# EasyEDA Pro project ProPrj_ESP32-S3-DEVKIT_Sensor_Project_2026-01-14.epro

# Schematic Schematic1
Board Name: Board1; Create Date: 2026-01-12; Page Name: P1; Project Name: ESP32-S3-DEVKIT_Sensor_Project; Schematic Name: Schematic1; Update Date: 2026-01-13; Company: EasyEDA.com; Page Size: A4; Version: V1.0
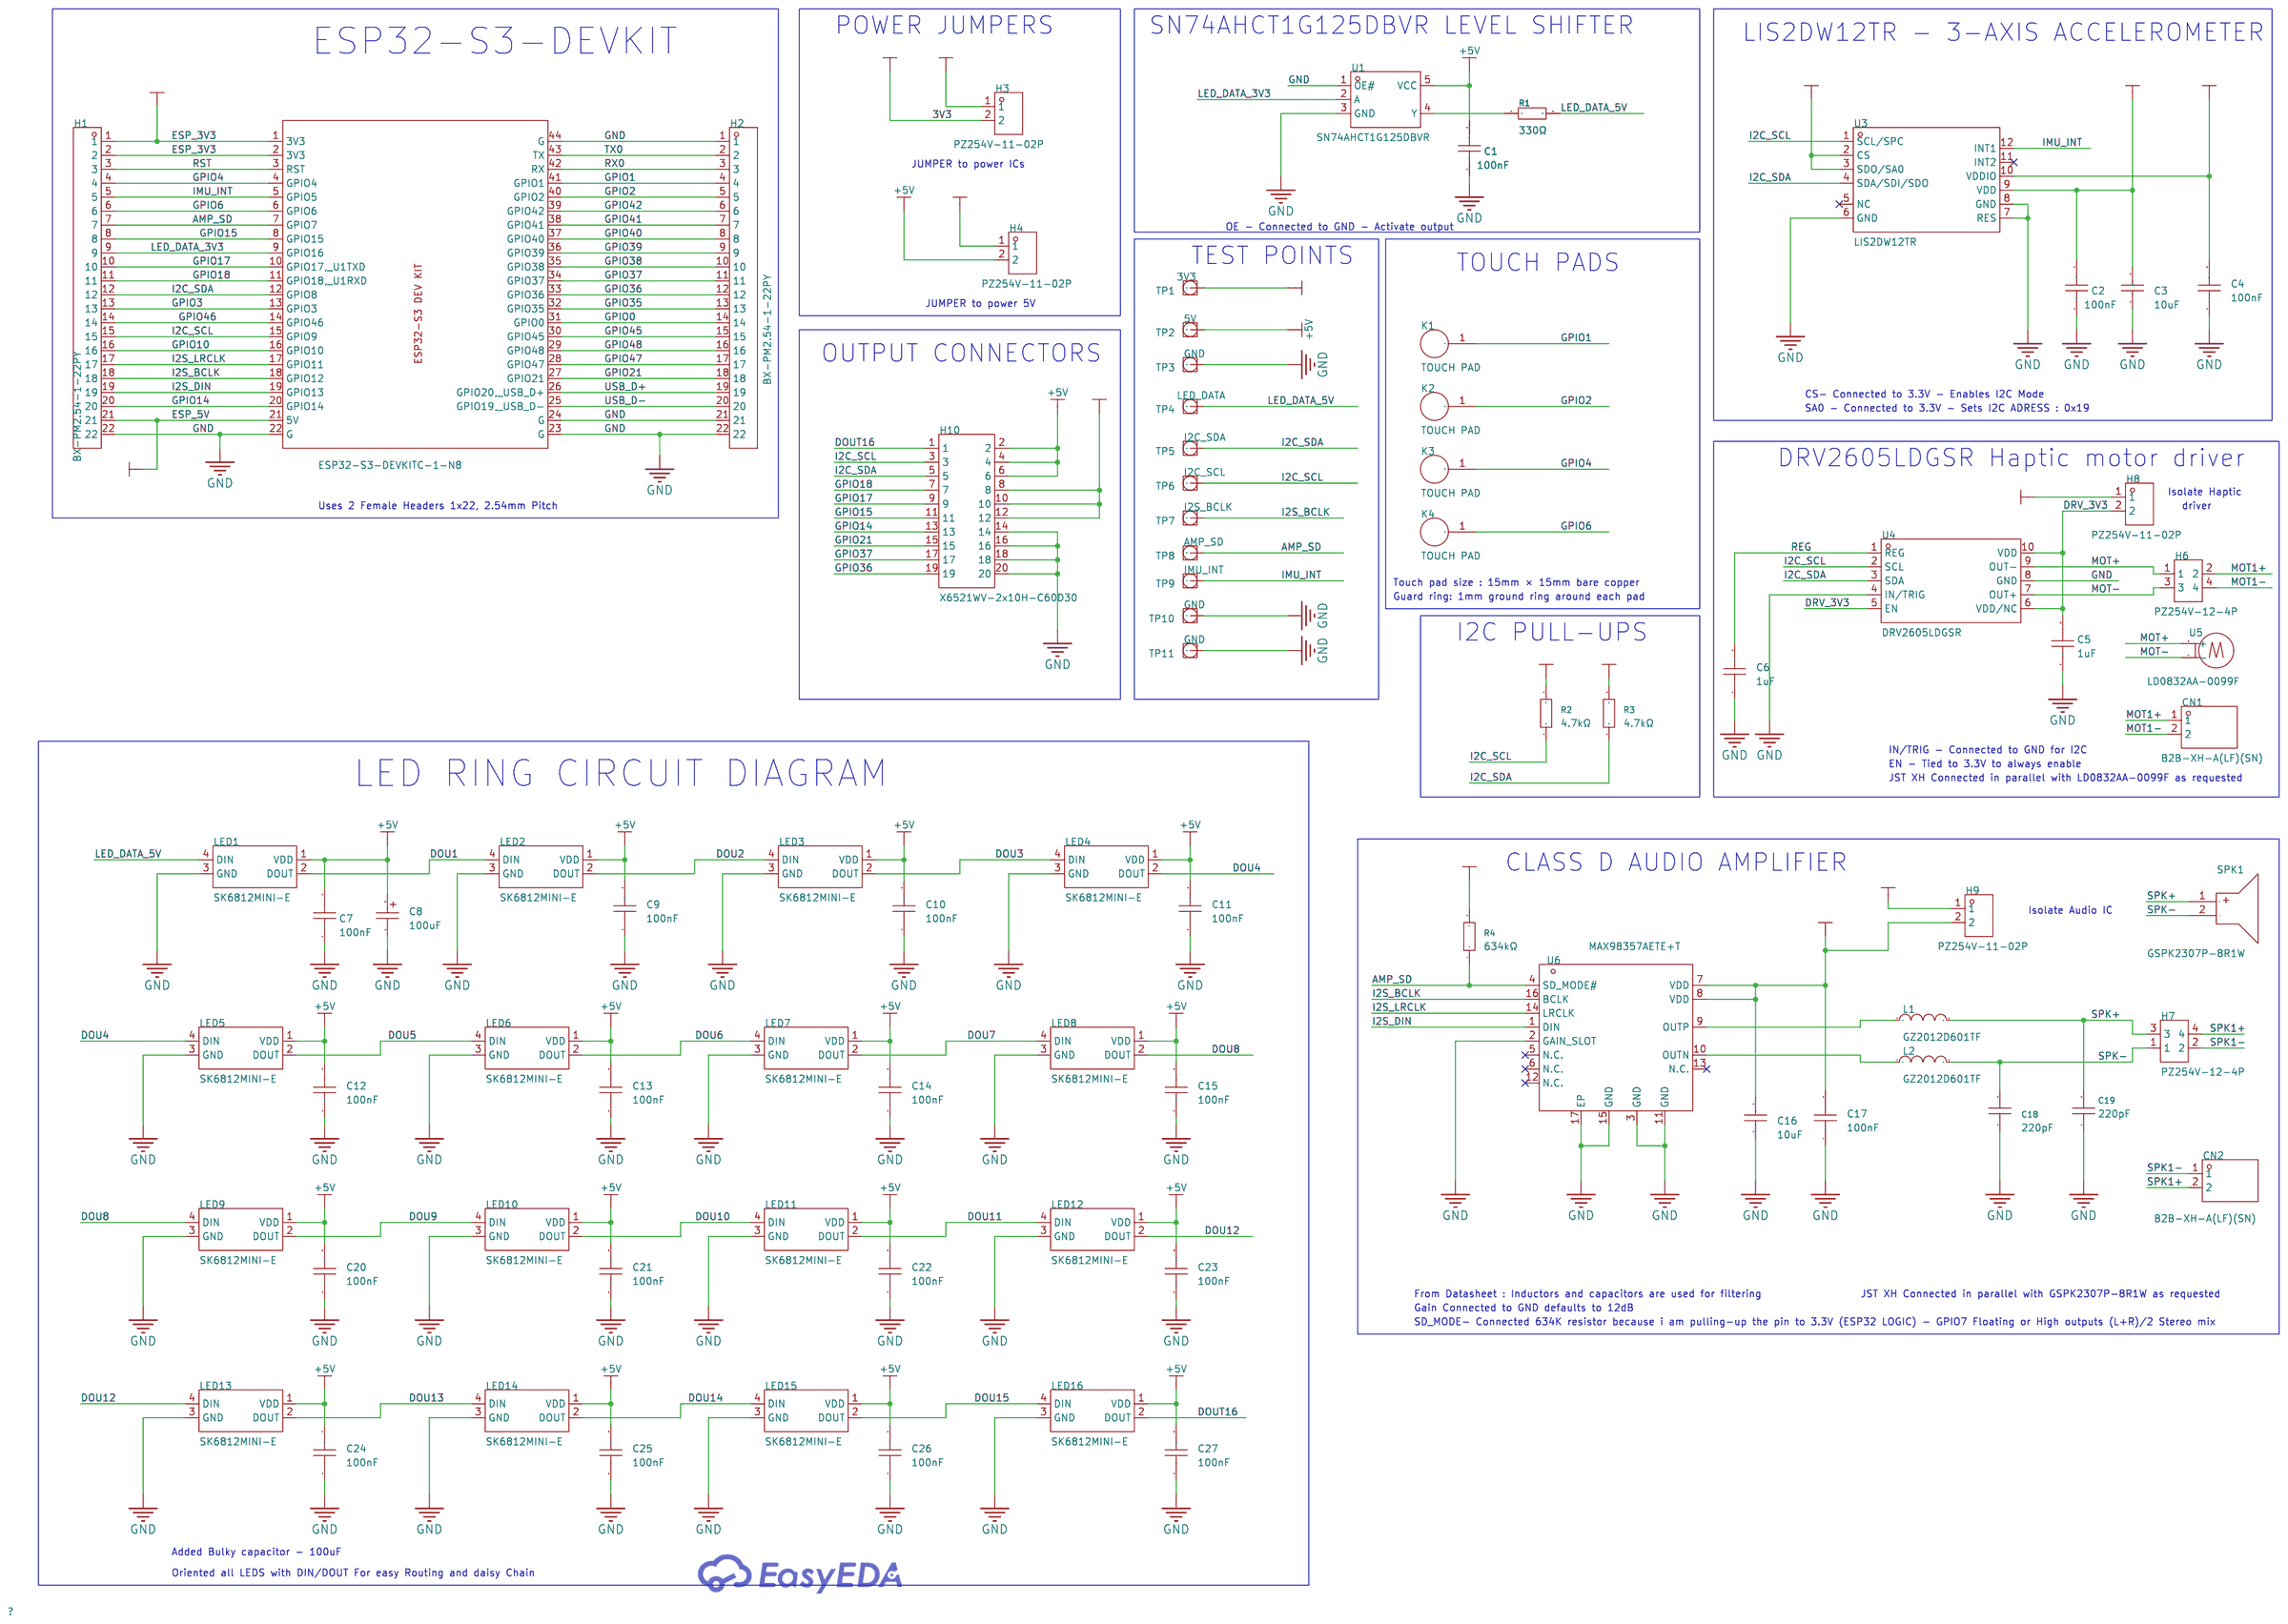
[diagram p0: schematic sheet]

## Parts
C1  100nF  [C0402]
C2  100nF  [C0402]
C3  10uF  [C0402]
C4  100nF  [C0402]
C5  1uF  [C0402]
C6  1uF  [C0402]
C7  100nF  [C0402]
C8  100uF  [CASE-B_3528]
C9  100nF  [C0402]
C10  100nF  [C0402]
C11  100nF  [C0402]
C12  100nF  [C0402]
C13  100nF  [C0402]
C14  100nF  [C0402]
C15  100nF  [C0402]
C16  10uF  [C0402]
C17  100nF  [C0402]
C18  220pF  [C0603]
C19  220pF  [C0603]
C20  100nF  [C0402]
C21  100nF  [C0402]
C22  100nF  [C0402]
C23  100nF  [C0402]
C24  100nF  [C0402]
C25  100nF  [C0402]
C26  100nF  [C0402]
C27  100nF  [C0402]
CN1  B2B-XH-A(LF)(SN)  [CONN-TH_B2B-XH-A-LF-SN]
CN2  B2B-XH-A(LF)(SN)  [CONN-TH_B2B-XH-A-LF-SN]
H1  BX-PM2.54-1-22PY  [HDR-TH_22P-P2.54-V-F]
H2  BX-PM2.54-1-22PY  [HDR-TH_22P-P2.54-V-F]
H3  PZ254V-11-02P  [HDR-TH_2P-P2.54-V-M]
H4  PZ254V-11-02P  [HDR-TH_2P-P2.54-V-M]
H6  PZ254V-12-4P  [HDR-TH_4P-P2.54-V-M-R2-C2-S2.54]
H7  PZ254V-12-4P  [HDR-TH_4P-P2.54-V-M-R2-C2-S2.54]
H8  PZ254V-11-02P  [HDR-TH_2P-P2.54-V-M]
H9  PZ254V-11-02P  [HDR-TH_2P-P2.54-V-M]
H10  X6521WV-2x10H-C60D30  [HDR-TH_20P-P2.54-V-M-R2-C10-S2.54]
K1  TOUCH PAD  [TOUCH_PAD]
K2  TOUCH PAD  [TOUCH_PAD]
K3  TOUCH PAD  [TOUCH_PAD]
K4  TOUCH PAD  [TOUCH_PAD]
L1  GZ2012D601TF  [L0805]
L2  GZ2012D601TF  [L0805]
LED1  SK6812MINI-E  [LED-SMD_L3.2-W2.8-LS5.9_SK6812MINI-E]
LED2  SK6812MINI-E  [LED-SMD_L3.2-W2.8-LS5.9_SK6812MINI-E]
LED3  SK6812MINI-E  [LED-SMD_L3.2-W2.8-LS5.9_SK6812MINI-E]
LED4  SK6812MINI-E  [LED-SMD_L3.2-W2.8-LS5.9_SK6812MINI-E]
LED5  SK6812MINI-E  [LED-SMD_L3.2-W2.8-LS5.9_SK6812MINI-E]
LED6  SK6812MINI-E  [LED-SMD_L3.2-W2.8-LS5.9_SK6812MINI-E]
LED7  SK6812MINI-E  [LED-SMD_L3.2-W2.8-LS5.9_SK6812MINI-E]
LED8  SK6812MINI-E  [LED-SMD_L3.2-W2.8-LS5.9_SK6812MINI-E]
LED9  SK6812MINI-E  [LED-SMD_L3.2-W2.8-LS5.9_SK6812MINI-E]
LED10  SK6812MINI-E  [LED-SMD_L3.2-W2.8-LS5.9_SK6812MINI-E]
LED11  SK6812MINI-E  [LED-SMD_L3.2-W2.8-LS5.9_SK6812MINI-E]
LED12  SK6812MINI-E  [LED-SMD_L3.2-W2.8-LS5.9_SK6812MINI-E]
LED13  SK6812MINI-E  [LED-SMD_L3.2-W2.8-LS5.9_SK6812MINI-E]
LED14  SK6812MINI-E  [LED-SMD_L3.2-W2.8-LS5.9_SK6812MINI-E]
LED15  SK6812MINI-E  [LED-SMD_L3.2-W2.8-LS5.9_SK6812MINI-E]
LED16  SK6812MINI-E  [LED-SMD_L3.2-W2.8-LS5.9_SK6812MINI-E]
R1  330Ω  [R0402]
R2  4.7kΩ  [R0402]
R3  4.7kΩ  [R0402]
R4  634kΩ  [R0402]
SPK1  GSPK2307P-8R1W  [SPK-TH_BD23.0-P10.00-D0.8-L-RD]
TP1  3V3  [TESTPOINT-TH_BD3.2_1]
TP2  5V  [TESTPOINT-TH_BD3.2_1]
TP3  GND  [TESTPOINT-TH_BD3.2_1]
TP4  LED_DATA  [TESTPOINT-TH_BD3.2_1]
TP5  I2C_SDA  [TESTPOINT-TH_BD3.2_1]
TP6  I2C_SCL  [TESTPOINT-TH_BD3.2_1]
TP7  I2S_BCLK  [TESTPOINT-TH_BD3.2_1]
TP8  AMP_SD  [TESTPOINT-TH_BD3.2_1]
TP9  IMU_INT  [TESTPOINT-TH_BD3.2_1]
TP10  GND  [TESTPOINT-TH_BD3.2_1]
TP11  GND  [TESTPOINT-TH_BD3.2_1]
U1  SN74AHCT1G125DBVR  [SOT-23-5_L3.0-W1.7-P0.95-LS2.8-BR]
U2  ESP32-S3-DEVKITC-1-N8  [CONN-TH_ESP32-S3-DEVKITC-1U-N8]
U3  LIS2DW12TR  [LGA-12_L2.0-W2.0-P0.50-BL]
U4  DRV2605LDGSR  [VSSOP-10_L3.0-W3.0-P0.50-LS4.9-BL]
U5  LD0832AA-0099F  [FL_002]
U6  MAX98357AETE+T  [TQFN-16_L3.0-W3.0-P0.50-BL-EP1.5]

## Library data of the parts
C1 C2 C4 C7 C9-C15 C17 C20-C27 = CL05B104KO5NNNC: Capacitance:100nF Tolerance:±10% Tolerance:±10% Voltage Rating:16V Temperature Coefficient:X7R; LCSC Part Name: 100nF ±10% 16V; Supplier Part: C1525; Manufacturer: SAMSUNG(三星); Supplier Footprint: 0402; Datasheet: https://item.szlcsc.com/datasheet/CL05B104KO5NNNC/1877.html; Supplier: LCSC; Tolerance: ±10%; Voltage Rating: 16V; Temperature Coefficient: X7R
C3 C16 = CL05A106MQ5NUNC: Capacitance:10uF Tolerance:±20% Tolerance:±20% Voltage Rating:6.3V Temperature Coefficient:X5R; LCSC Part Name: 10uF ±20% 6.3V; Supplier Part: C15525; Manufacturer: SAMSUNG(三星); Supplier Footprint: 0402; Datasheet: https://item.szlcsc.com/datasheet/CL05A106MQ5NUNC/16204.html; Supplier: LCSC; Tolerance: ±20%; Voltage Rating: 6.3V; Temperature Coefficient: X5R
C5 C6 = CL05A105KA5NQNC: Capacitance:1uF Tolerance:±10% Tolerance:±10% Voltage Rating:25V Temperature Coefficient:X5R; LCSC Part Name: 1uF ±10% 25V; Supplier Part: C52923; Manufacturer: SAMSUNG(三星); Supplier Footprint: 0402; Datasheet: https://item.szlcsc.com/datasheet/CL05A105KA5NQNC/53938.html; Supplier: LCSC; Tolerance: ±10%; Voltage Rating: 25V; Temperature Coefficient: X5R
C8 = TAJB107M010RNJ: Capacitance: Tolerance:±20% Tolerance:±20% Rated Voltage: Equivalent Series Resistance(ESR):1.4Ω@100kHz Operating Temperature:-55℃~+125℃ Operating Temperature:-55℃~+125℃; LCSC Part Name: 100uF ±20% 10V; Supplier Part: C7196; Manufacturer: Kyocera AVX; Supplier Footprint: CASE-B-3528; Datasheet: https://atta.szlcsc.com/upload/public/pdf/source/20160107/1457707750344.pdf; Supplier: LCSC; Tolerance: ±20%; Equivalent Series Resistance(ESR): 1.4Ω@100kHz; Operating Temperature: -55℃~+125℃
C18 C19 = CL10B221KB8NNNC: Capacitance:220pF Tolerance:±10% Tolerance:±10% Voltage Rating:50V Temperature Coefficient:X7R; LCSC Part Name: 220pF ±10% 50V; Supplier Part: C1603; Manufacturer: SAMSUNG(三星); Supplier Footprint: 0603; JLCPCB Part Class: Basic Part; Datasheet: https://item.szlcsc.com/datasheet/CL10B221KB8NNNC/1955.html; Supplier: LCSC; Tolerance: ±10%; Voltage Rating: 50V; Temperature Coefficient: X7R
CN1 CN2 = B2B-XH-A(LF)(SN): Pins Structure:1x2P Pitch:2.5mm Mounting Type:Through Hole Reference Series:XH Number of Pins:2P Number of Rows:1 Number of PINs Per Row:2 Row Spacing:- Current Rating:3A Contact Material:Brass Contact Plating:Tin Operating Temperature:-25℃~+85℃ Operating; LCSC Part Name: 1x2P 间距:2.5mm 直插 系列:XH; Supplier Part: C158012; Manufacturer: JST; Supplier Footprint: 插件,P=2.5mm; Datasheet: https://item.szlcsc.com/datasheet/B2B-XH-A(LF)(SN)/169360.html; Supplier: LCSC; Pins Structure: 1x2P; Pitch: 2.5mm; Mounting Type: Through Hole; Reference Series: XH; Number of Pins: 2P; Number of Rows: 1; Number of PINs Per Row: 2; Current Rating: 3A; Contact Material: Brass; Contact Plating: Tin; Operating Temperature: -25℃~+85℃; Voltage Rating: 250V; Plastic Material: PA66; Flame Retardant Rating: UL94V-0; Supplementary Features: K Pin; Color: White; Z-Height of the Board: 7mm; X-Length of Bottom Edge on Board (Spacing Line): 7.4mm; Y-Width of Bottom Edge on Board: 5.75mm
H1 H2 = BX-PM2.54-1-22PY: Holes Structure:1x22P Pitch:2.54mm Row Spacing:- Circular Hole / Square Hole:Square Hole Mounting Type:Through Hole Number of Rows:1 Number of Positions:22P Current Rating:3A Voltage Rating (Max):- Holes Direction:Top Insulation Height:8.5mm Contact Mater; LCSC Part Name: 1x22P 间距:2.54mm 直插; Supplier Part: C18078140; Manufacturer: Bossie(博锡); Supplier Footprint: 插件,P=2.54mm; Datasheet: https://item.szlcsc.com/datasheet/BX-PM2.54-1-22PY/19218541.html; Supplier: LCSC; Holes Structure: 1x22P; Pitch: 2.54mm; Circular Hole / Square Hole: Square Hole; Mounting Type: Through Hole; Number of Rows: 1; Number of Positions: 22P; Current Rating: 3A; Holes Direction: Top; Insulation Height: 8.5mm; Contact Material: Brass; Contact Plating: Gold; Operating Temperature: -40℃~+105℃; PIN Length: 3.2mm
H3 H4 H8 H9 = PZ254V-11-02P: Supplier: LCSC; Supplier Part: C492401; Manufacturer: XFCN; JLCPCB Part Class: Extended Part
H6 H7 = PZ254V-12-4P: Pin Structure:2x2P Pitch:2.54mm Row Spacing:2.54mm Circluar Pins/Square Pins:Pin Header Mounting Type:Through Hole Number of Rows:2 Number of Pins:4P Current Rating:- Voltage Rating (Max):- Length of Mating Pin:6mm Insulation Height:2.5mm Length of End Co; LCSC Part Name: 2x2P 间距:2.54mm 方针 直插; Supplier Part: C492419; Manufacturer: XFCN(兴飞); Supplier Footprint: 插件,P=2.54mm; JLCPCB Part Class: Extended Part; Datasheet: https://item.szlcsc.com/datasheet/PZ254V-12-4P/502975.html; Supplier: LCSC; Pin Structure: 2x2P; Pitch: 2.54mm; Row Spacing: 2.54mm; Circluar Pins/Square Pins: Pin Header; Mounting Type: Through Hole; Number of Rows: 2; Number of Pins: 4P; Length of Mating Pin: 6mm; Insulation Height: 2.5mm; Length of End Connection Pin: 3mm; Contact Material: Brass; Operating Temperature: -40℃~+105℃; Color: Black
H10 = X6521WV-2x10H-C60D30: Pin Structure:2x10P Pitch:2.54mm Row Spacing:2.54mm Circluar Pins/Square Pins:Policy Number of Rows:Double Row Number of Pins:20P Current Rating:3A Voltage Rating (Max):250V Length of Mating Pin:- Insulation Height:2.5mm Length of End Connection Pin:- Con; LCSC Part Name: 2x10P 间距:2.54mm 方针; Supplier Part: C706900; Manufacturer: XKB Connection(中国星坤); Supplier Footprint: 插件,P=2.54mm; Datasheet: https://item.szlcsc.com/datasheet/X6521WV-2x10H-C60D30/744022.html; Supplier: LCSC; Pin Structure: 2x10P; Pitch: 2.54mm; Row Spacing: 2.54mm; Circluar Pins/Square Pins: Policy; Number of Rows: Double Row; Number of Pins: 20P; Current Rating: 3A; Voltage Rating (Max): 250V; Insulation Height: 2.5mm; Contact Material: Brass; Contact Plating: Gold; Operating Temperature: -40℃~+105℃; Color: Black
K1-K4 = TOUCH PAD: Manufacturer Part: Touch
L1 L2 = GZ2012D601TF: Impedance @ Frequency:600Ω@100MHz Tolerance:±25% Tolerance:±25% DC Resistance(DCR):300mΩ Current Rating:500mA Number of Circuits:1; LCSC Part Name: 单路 0805磁珠 阻抗600Ω@100MHz; Supplier Part: C1017; Manufacturer: Sunlord(顺络); Supplier Footprint: 0805; JLCPCB Part Class: Basic Part; Datasheet: https://atta.szlcsc.com/upload/public/pdf/source/20241120/893429B990C3BA07384E734821D2F218.pdf; Supplier: LCSC; Impedance @ Frequency: 600Ω@100MHz; Tolerance: ±25%; DC Resistance(DCR): 300mΩ; Current Rating: 500mA; Number of Circuits: 1
LED1-LED16 = SK6812MINI-E_C5149201: Supplier Part: C5149201; Manufacturer: 欧思科光电; Supplier Footprint: SMD; Datasheet: https://item.szlcsc.com/datasheet/SK6812MINI-E/5773397.html; Supplier: LCSC
R1 = 0402WGF3300TCE: Type:Thick Film Resistors Resistance:330Ω Tolerance:±1% Tolerance:±1% Power(Watts):1/16W Voltage-Supply(Max):50V Temperature Coefficient:±100ppm/℃ Temperature Coefficient:±100ppm/℃ Operating Temperature:-55℃~+155℃ Operating Temperature:-55℃~+155℃; LCSC Part Name: 330Ω ±1% 62.5mW 厚膜电阻; Supplier Part: C25104; Manufacturer: UNI-ROYAL(厚声); Supplier Footprint: 0402; Datasheet: https://item.szlcsc.com/datasheet/0402WGF3300TCE/25847.html; Supplier: LCSC; Type: Thick Film Resistors; Tolerance: ±1%; Power(Watts): 1/16W; Voltage-Supply(Max): 50V; Temperature Coefficient: ±100ppm/℃; Operating Temperature: -55℃~+155℃
R2 R3 = 0402WGF4701TCE: Type:Thick Film Resistor Resistance:4.7kΩ Tolerance:±1% Tolerance:±1% Power(Watts):62.5mW Voltage-Supply(Max):50V Temperature Coefficient:±100ppm/℃ Temperature Coefficient:±100ppm/℃ Operating Temperature:-55℃~+155℃ Operating Temperature:-55℃~+155℃; LCSC Part Name: 4.7kΩ ±1% 62.5mW 厚膜电阻; Supplier Part: C25900; Manufacturer: UNI-ROYAL(厚声); Supplier Footprint: 0402; Datasheet: https://item.szlcsc.com/datasheet/0402WGF4701TCE/26643.html; Supplier: LCSC; Type: Thick Film Resistor; Tolerance: ±1%; Power(Watts): 62.5mW; Voltage-Supply(Max): 50V; Temperature Coefficient: ±100ppm/℃; Operating Temperature: -55℃~+155℃
R4 = 0402WGF6343TCE: Type:Thick Film Resistor Resistance:634kΩ Tolerance:±1% Tolerance:±1% Power(Watts):62.5mW Voltage-Supply(Max):50V Temperature Coefficient:±100ppm/℃ Temperature Coefficient:±100ppm/℃ Operating Temperature:-55℃~+155℃ Operating Temperature:-55℃~+155℃; LCSC Part Name: 634kΩ ±1% 62.5mW 厚膜电阻; Supplier Part: C270588; Manufacturer: UNI-ROYAL(厚声); Supplier Footprint: 0402; Datasheet: https://item.szlcsc.com/datasheet/0402WGF6343TCE/259968.html; Supplier: LCSC; Type: Thick Film Resistor; Tolerance: ±1%; Power(Watts): 62.5mW; Voltage-Supply(Max): 50V; Temperature Coefficient: ±100ppm/℃; Operating Temperature: -55℃~+155℃
SPK1 = GSPK2307P-8R1W: Technology:Electromagnetic Impedance:8Ω Resonant Frequency:1.7kHz Total Harmonic Distortion(THD):5% Total Harmonic Distortion(THD):5% Rated Power:500mW Sound Pressure Level(SPL):88dB Diameter(φD):23mm Height:6.8mm Operating Temperature:-40℃~+85℃ Operating; LCSC Part Name: 23mm 8Ω; Supplier Part: C530531; Manufacturer: INGHAi(赢海); JLCPCB Part Class: Extended Part; Datasheet: https://item.szlcsc.com/datasheet/GSPK2307P-8R1W/550865.html; Supplier: LCSC; Technology: Electromagnetic; Impedance: 8Ω; Resonant Frequency: 1.7kHz; Total Harmonic Distortion(THD): 5%; Rated Power: 500mW; Sound Pressure Level(SPL): 88dB; Diameter(φD): 23mm; Height: 6.8mm; Operating Temperature: -40℃~+85℃
TP1-TP11 = TPoint2: Test Point; Supplier Part: C9900007422; Supplier Footprint: TESTPOINT-TH_BD-2P-P2.00; Supplier: LCSC
U1 = SN74AHCT1G125DBVR: output type:Tri-State Voltage - Supply:4.5V~5.5V Voltage - Supply:4.5V~5.5V Number of Elements:1 Number of Bits per Element:1 Channel Type:Unidirectional Current - Output Low(IOL):8mA Current - Output High(IOH):8mA Logic Family:74AHCT Operating Temperatur; LCSC Part Name: 三态输出，单路总线缓冲门; Supplier Part: C7484; Manufacturer: TI(德州仪器); Supplier Footprint: SOT-23-5; JLCPCB Part Class: Extended Part; Datasheet: https://www.ti.com/cn/lit/gpn/sn74ahct1g125; Supplier: LCSC; output type: Tri-State; Voltage - Supply: 4.5V~5.5V; Number of Elements: 1; Number of Bits per Element: 1; Channel Type: Unidirectional; Current - Output Low(IOL): 8mA; Current - Output High(IOH): 8mA; Logic Family: 74AHCT; Operating Temperature: -40℃~+125℃; Quiescent Current: 10uA; Propagation Delay: 6.5ns@5V,15pF
U2 = ESP32-S3-DEVKITC-1-N8: Supplier Part: C20438410; Manufacturer: ESPRESSIF(乐鑫); JLCPCB Part Class: Extended Part; Supplier: LCSC
U3 = LIS2DW12TR: Axial Direction:X,Y,Z Supply Voltage:1.62V~3.6V Supply Voltage:1.62V~3.6V Operating Temperature:-40℃~+85℃ Operating Temperature:-40℃~+85℃; Supplier Part: C189624; Manufacturer: ST(意法半导体); Supplier Footprint: LGA-12(2x2); Datasheet: https://atta.szlcsc.com/upload/public/pdf/source/20180403/C189624_150963097ED842400E055DE40577DCB1.pdf; Supplier: LCSC; Axial Direction: X,Y,Z; Supply Voltage: 1.62V~3.6V; Operating Temperature: -40℃~+85℃
U4 = DRV2605LDGSR: Voltage - Supply:- Voltage - Supply:- Output Current:- Output Current:- Interface:I2C Operating Temperature:-40℃~+85℃ Operating Temperature:-40℃~+85℃; LCSC Part Name: 5.5V电机驱动芯片; Supplier Part: C527464; Manufacturer: TI(德州仪器); Supplier Footprint: VSSOP-10-0.5mm; Datasheet: https://www.ti.com/cn/lit/gpn/drv2605l; Supplier: LCSC; Interface: I2C; Operating Temperature: -40℃~+85℃
U5 = LD0832AA-0099F: Type:Linear Motor Voltage Rating:1.8V Voltage Rating:1.8V Current Rating:80mA Operating Temperature:-30℃~+70℃ Operating Temperature:-30℃~+70℃ Sense Of Rotation:-; LCSC Part Name: 线性0832 振动马达; Supplier Part: C2682305; Manufacturer: LEADER(立得); JLCPCB Part Class: Extended Part; Datasheet: https://item.szlcsc.com/datasheet/LD0832AA-0099F/2776655.html; Supplier: LCSC; Type: Linear Motor; Voltage Rating: 1.8V; Current Rating: 80mA; Operating Temperature: -30℃~+70℃
U6 = MAX98357AETE+T: Class:Class D Speaker Channels:- Output Power:3.2W×1@4Ω Voltage - Supply:2.5V~5.5V Voltage - Supply:2.5V~5.5V Total Harmonic Distortion + Noise (THD+N):- Quiescent Current:2.4mA Operating Temperature:-40℃~+85℃ Operating Temperature:-40℃~+85℃ Power Supply; LCSC Part Name: 微型、低成本、PCM 类 D 级放大器具有 AB 级性能; Supplier Part: C910544; Manufacturer: ADI(亚德诺)/MAXIM(美信); Supplier Footprint: TQFN-16-EP(3x3); JLCPCB Part Class: Extended Part; Datasheet: https://item.szlcsc.com/datasheet/MAX98357AETE%252BT/978950.html; Supplier: LCSC; Class: Class D; Output Power: 3.2W×1@4Ω; Voltage - Supply: 2.5V~5.5V; Quiescent Current: 2.4mA; Operating Temperature: -40℃~+85℃; Power Supply Rejection Ratio (PSRR): 77dB; Efficiency: 92%

## Nets
3V3: C2.2 C3.2 C4.2 H3.2 H8.1 H10.8 H10.10 H10.12 R2.2 R3.2 R4.2 TP1.1 U3.2(CS) U3.3(SDO/SA0) U3.9(VDD) U3.10(VDDIO)
+5V: C1.2 C7.2 C8.1 C9.2 C10.2 C11.2 C12.2 C13.2 C14.2 C15.2 C20.2 C21.2 C22.2 C23.2 C24.2 C25.2 C26.2 C27.2 H4.2 H10.2 H10.4 H10.6 LED1.1(VDD) LED2.1(VDD) LED3.1(VDD) LED4.1(VDD) LED5.1(VDD) LED6.1(VDD) LED7.1(VDD) LED8.1(VDD) LED9.1(VDD) LED10.1(VDD) LED11.1(VDD) LED12.1(VDD) LED13.1(VDD) LED14.1(VDD) LED15.1(VDD) LED16.1(VDD) TP2.1 U1.5(VCC)
GND: C1.1 C2.1 C3.1 C4.1 C5.1 C6.1 C7.1 C8.2 C9.1 C10.1 C11.1 C12.1 C13.1 C14.1 C15.1 C16.1 C17.1 C18.1 C19.1 C20.1 C21.1 C22.1 C23.1 C24.1 C25.1 C26.1 C27.1 H1.22 H2.1 H2.21 H2.22 H10.14 H10.16 H10.18 H10.20 LED1.3(GND) LED2.3(GND) LED3.3(GND) LED4.3(GND) LED5.3(GND) LED6.3(GND) LED7.3(GND) LED8.3(GND) LED9.3(GND) LED10.3(GND) LED11.3(GND) LED12.3(GND) LED13.3(GND) LED14.3(GND) LED15.3(GND) LED16.3(GND) TP3.1 TP10.1 TP11.1 U1.1(OE#) U1.3(GND) U2.22(G) U2.23(G) U2.24(G) U2.44(G) U3.6(GND) U3.7(RES) U3.8(GND) U4.4(IN/TRIG) U4.8(GND) U6.2(GAIN_SLOT) U6.3(GND) U6.11(GND) U6.15(GND) U6.17(EP)
VCC_5V: C16.2 C17.2 H9.2 U6.7(VDD) U6.8(VDD)
AMP_SD: H1.7 R4.1 TP8.1 U2.7(GPIO7) U6.4(SD_MODE#)
DOU1: LED1.2(DOUT) LED2.4(DIN)
DOU2: LED2.2(DOUT) LED3.4(DIN)
DOU3: LED3.2(DOUT) LED4.4(DIN)
DOU4: LED4.2(DOUT) LED5.4(DIN)
DOU5: LED5.2(DOUT) LED6.4(DIN)
DOU6: LED6.2(DOUT) LED7.4(DIN)
DOU7: LED7.2(DOUT) LED8.4(DIN)
DOU8: LED8.2(DOUT) LED9.4(DIN)
DOU9: LED9.2(DOUT) LED10.4(DIN)
DOU10: LED10.2(DOUT) LED11.4(DIN)
DOU11: LED11.2(DOUT) LED12.4(DIN)
DOU12: LED12.2(DOUT) LED13.4(DIN)
DOU13: LED13.2(DOUT) LED14.4(DIN)
DOU14: LED14.2(DOUT) LED15.4(DIN)
DOU15: LED15.2(DOUT) LED16.4(DIN)
DOUT16: H10.1 LED16.2(DOUT)
DRV_3V3: C5.2 H8.2 U4.5(EN) U4.6(VDD/NC) U4.10(VDD)
ESP_3V3: H1.1 H1.2 H3.1 U2.1(3V3) U2.2(3V3)
ESP_5V: H1.21 H4.1 H9.1 U2.21(5V)
GPIO0: H2.14 U2.31(GPIO0)
GPIO1: H2.4 K1.1 U2.41(GPIO1)
GPIO2: H2.5 K2.1 U2.40(GPIO2)
GPIO3: H1.13 U2.13(GPIO3)
GPIO4: H1.4 K3.1 U2.4(GPIO4)
GPIO6: H1.6 K4.1 U2.6(GPIO6)
GPIO10: H1.16 U2.16(GPIO10)
GPIO14: H1.20 H10.13 U2.20(GPIO14)
GPIO15: H1.8 H10.11 U2.8(GPIO15)
GPIO17: H1.10 H10.9 U2.10(GPIO17, U1TXD)
GPIO18: H1.11 H10.7 U2.11(GPIO18, U1RXD)
GPIO21: H2.18 H10.15 U2.27(GPIO21)
GPIO35: H2.13 U2.32(GPIO35)
GPIO36: H2.12 H10.19 U2.33(GPIO36)
GPIO37: H2.11 H10.17 U2.34(GPIO37)
GPIO38: H2.10 U2.35(GPIO38)
GPIO39: H2.9 U2.36(GPIO39)
GPIO40: H2.8 U2.37(GPIO40)
GPIO41: H2.7 U2.38(GPIO41)
GPIO42: H2.6 U2.39(GPIO42)
GPIO45: H2.15 U2.30(GPIO45)
GPIO46: H1.14 U2.14(GPIO46)
GPIO47: H2.17 U2.28(GPIO47)
GPIO48: H2.16 U2.29(GPIO48)
I2C_SCL: H1.15 H10.3 R2.1 TP6.1 U2.15(GPIO9) U3.1(SCL/SPC) U4.2(SCL)
I2C_SDA: H1.12 H10.5 R3.1 TP5.1 U2.12(GPIO8) U3.4(SDA/SDI/SDO) U4.3(SDA)
I2S_BCLK: H1.18 TP7.1 U2.18(GPIO12) U6.16(BCLK)
I2S_DIN: H1.19 U2.19(GPIO13) U6.1(DIN)
I2S_LRCLK: H1.17 U2.17(GPIO11) U6.14(LRCLK)
IMU_INT: H1.5 TP9.1 U2.5(GPIO5) U3.12(INT1)
LED_DATA_3V3: H1.9 U1.2(A) U2.9(GPIO16)
LED_DATA_5V: LED1.4(DIN) R1.2 TP4.1
MOT1+: CN1.1 H6.2
MOT1-: CN1.2 H6.4
MOT+: H6.1 U4.9(OUT-) U5.2(+)
MOT-: H6.3 U4.7(OUT+) U5.1(-)
REG: C6.2 U4.1(REG)
RST: H1.3 U2.3(RST)
RX0: H2.3 U2.42(RX)
SPK1+: CN2.2 H7.4
SPK1-: CN2.1 H7.2
SPK+: C19.2 H7.3 L1.2 SPK1.1(+)
SPK-: C18.2 H7.1 L2.2 SPK1.2(-)
TX0: H2.2 U2.43(TX)
USB_D+: H2.19 U2.26(GPIO20, USB_D+)
USB_D-: H2.20 U2.25(GPIO19, USB_D-)
$1N2845: L2.1 U6.10(OUTN)
$1N2846: L1.1 U6.9(OUTP)
$1N3639: R1.1 U1.4(Y)

Not connected (* = marked no-connect by the designer): U3 5(NC)* 11(INT2)*; U6 5(N.C.)* 6(N.C.)* 12(N.C.)* 13(N.C.)*

## Notes on the sheet
- POWER JUMPERS
- SN74AHCT1G125DBVR LEVEL SHIFTER
- LIS2DW12TR - 3-AXIS ACCELEROMETER
- ESP32-S3-DEVKIT
- JUMPER to power ICs
- OE - Connected to GND - Activate output
- TEST POINTS
- TOUCH PADS
- JUMPER to power 5V
- OUTPUT CONNECTORS
- CS- Connected to 3.3V - Enables I2C Mode
- SA0 - Connected to 3.3V - Sets I2C ADRESS : 0x19
- DRV2605LDGSR Haptic motor driver
- Uses 2 Female Headers 1x22, 2.54mm Pitch
- Isolate Haptic
- driver
- Touch pad size : 15mm × 15mm bare copper
- Guard ring: 1mm ground ring around each pad
- I2C PULL-UPS
- IN/TRIG - Connected to GND for I2C
- EN - Tied to 3.3V to always enable
- LED RING CIRCUIT DIAGRAM
- JST XH Connected in parallel with LD0832AA-0099F as requested
- CLASS D AUDIO AMPLIFIER
- Isolate Audio IC
- From Datasheet : Inductors and capacitors are used for filtering
- JST XH Connected in parallel with GSPK2307P-8R1W as requested
- Gain Connected to GND defaults to 12dB
- SD_MODE- Connected 634K resistor because i am pulling-up the pin to 3.3V (ESP32 LOGIC) - GPIO7 Floating or High outputs (L+R)/2 Stereo mix
- Added Bulky capacitor - 100uF
- Oriented all LEDS with DIN/DOUT For easy Routing and daisy Chain

# Board PCB1
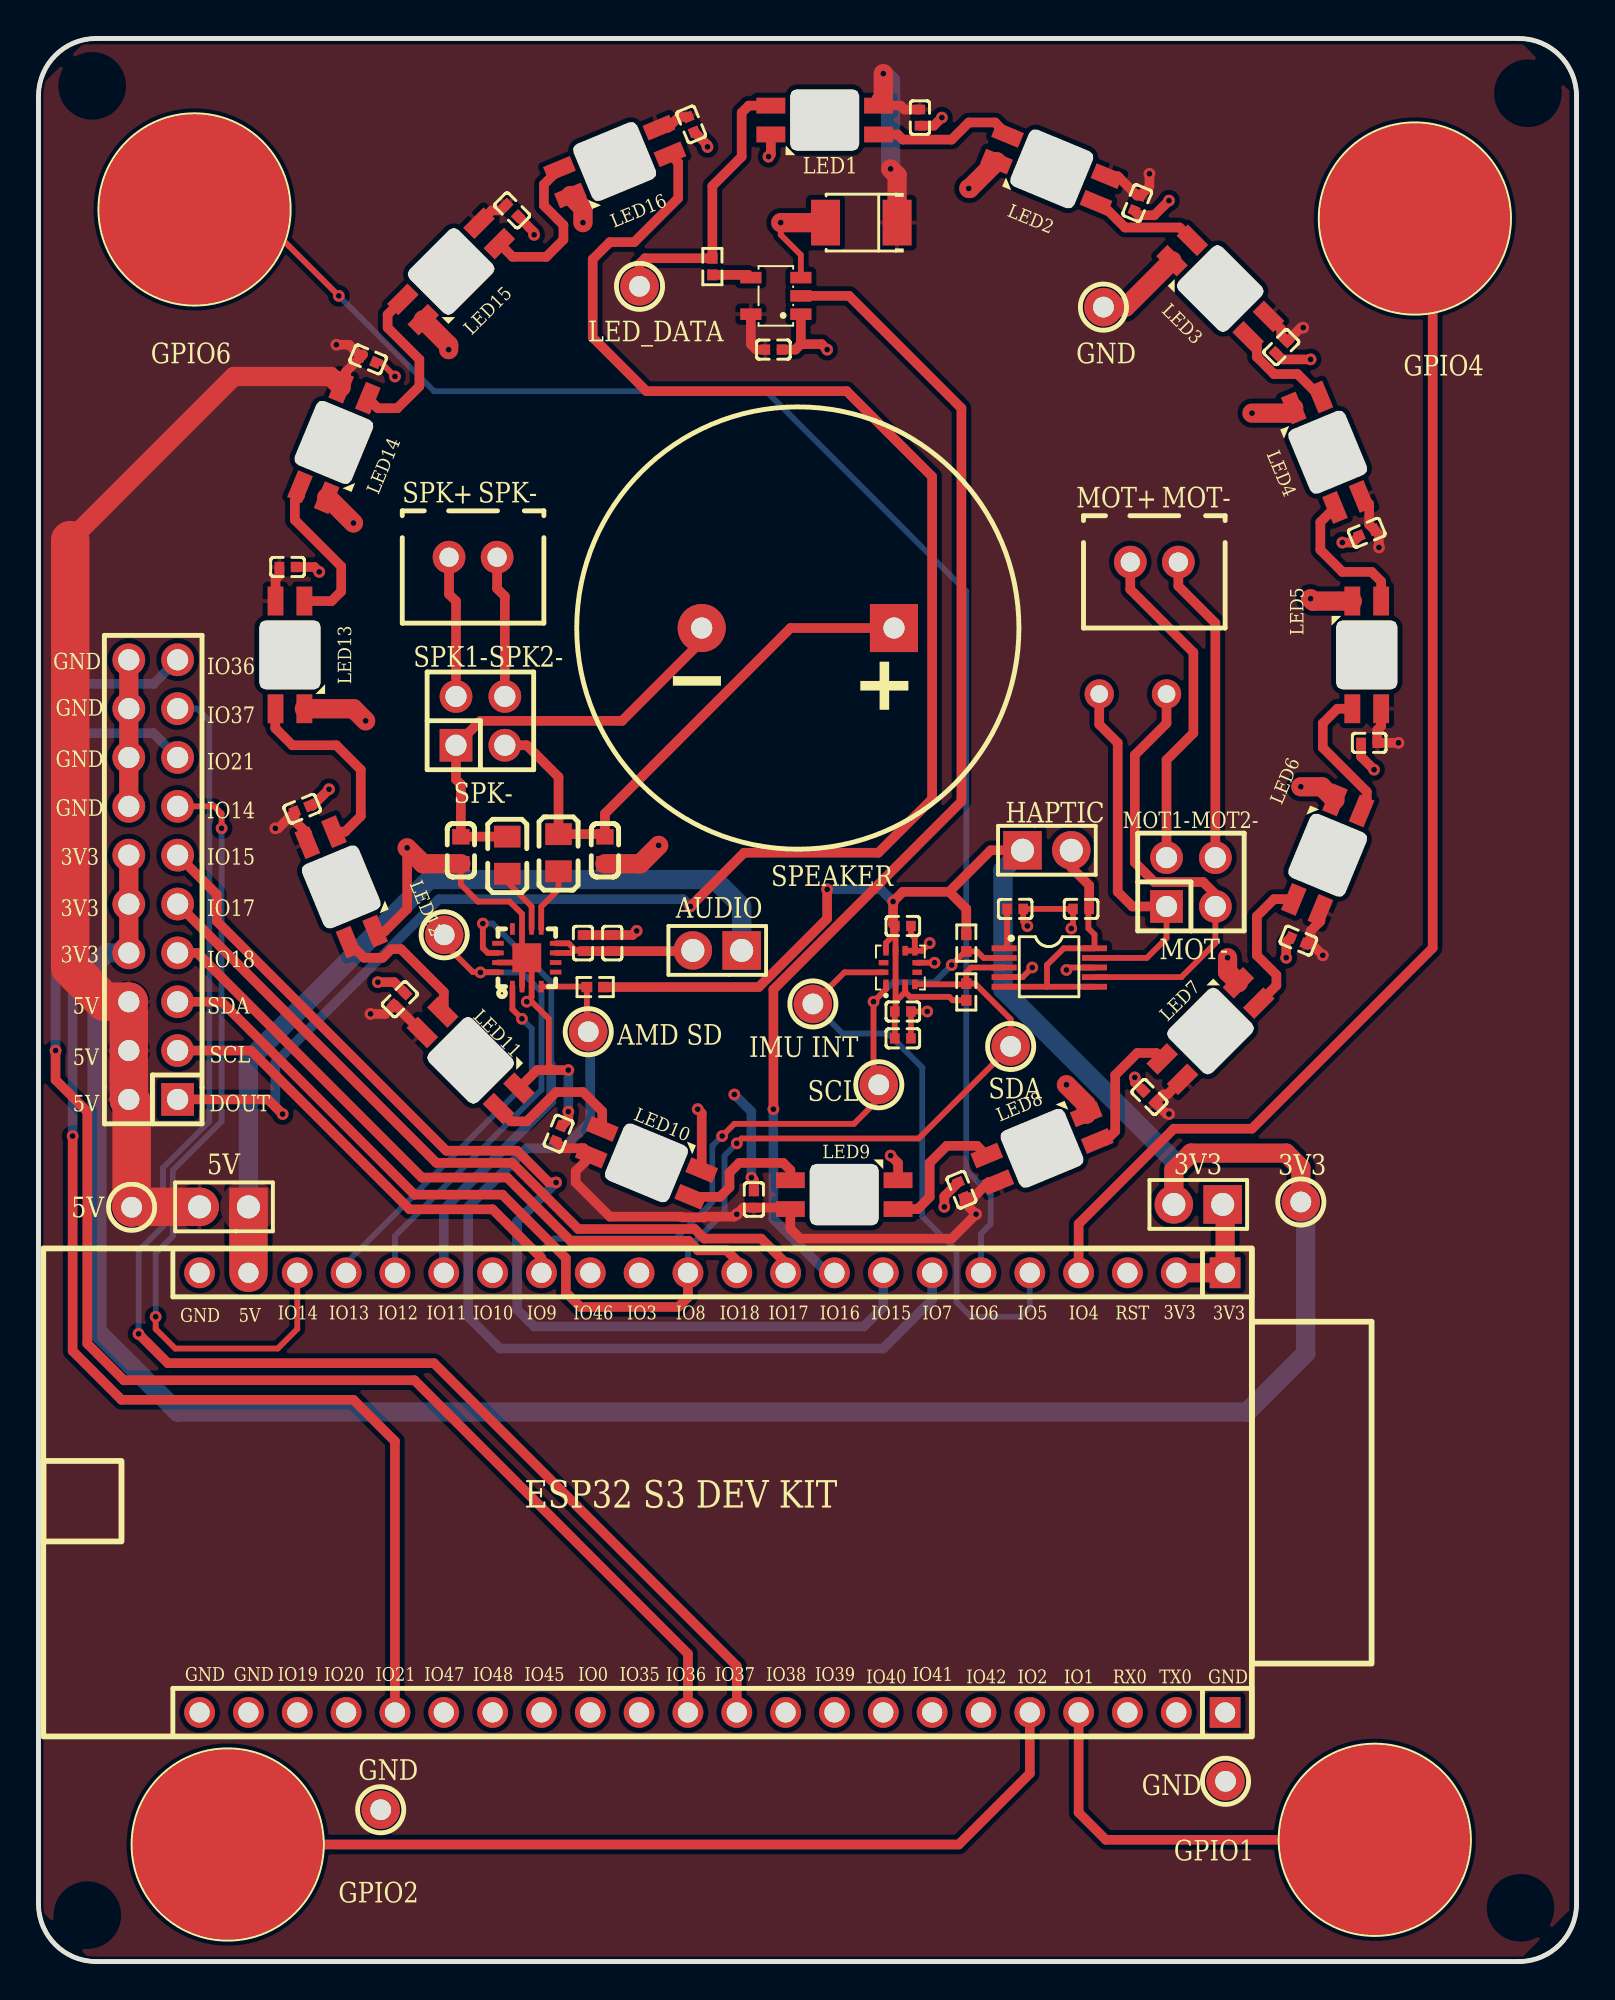
[diagram p1: board, top side]
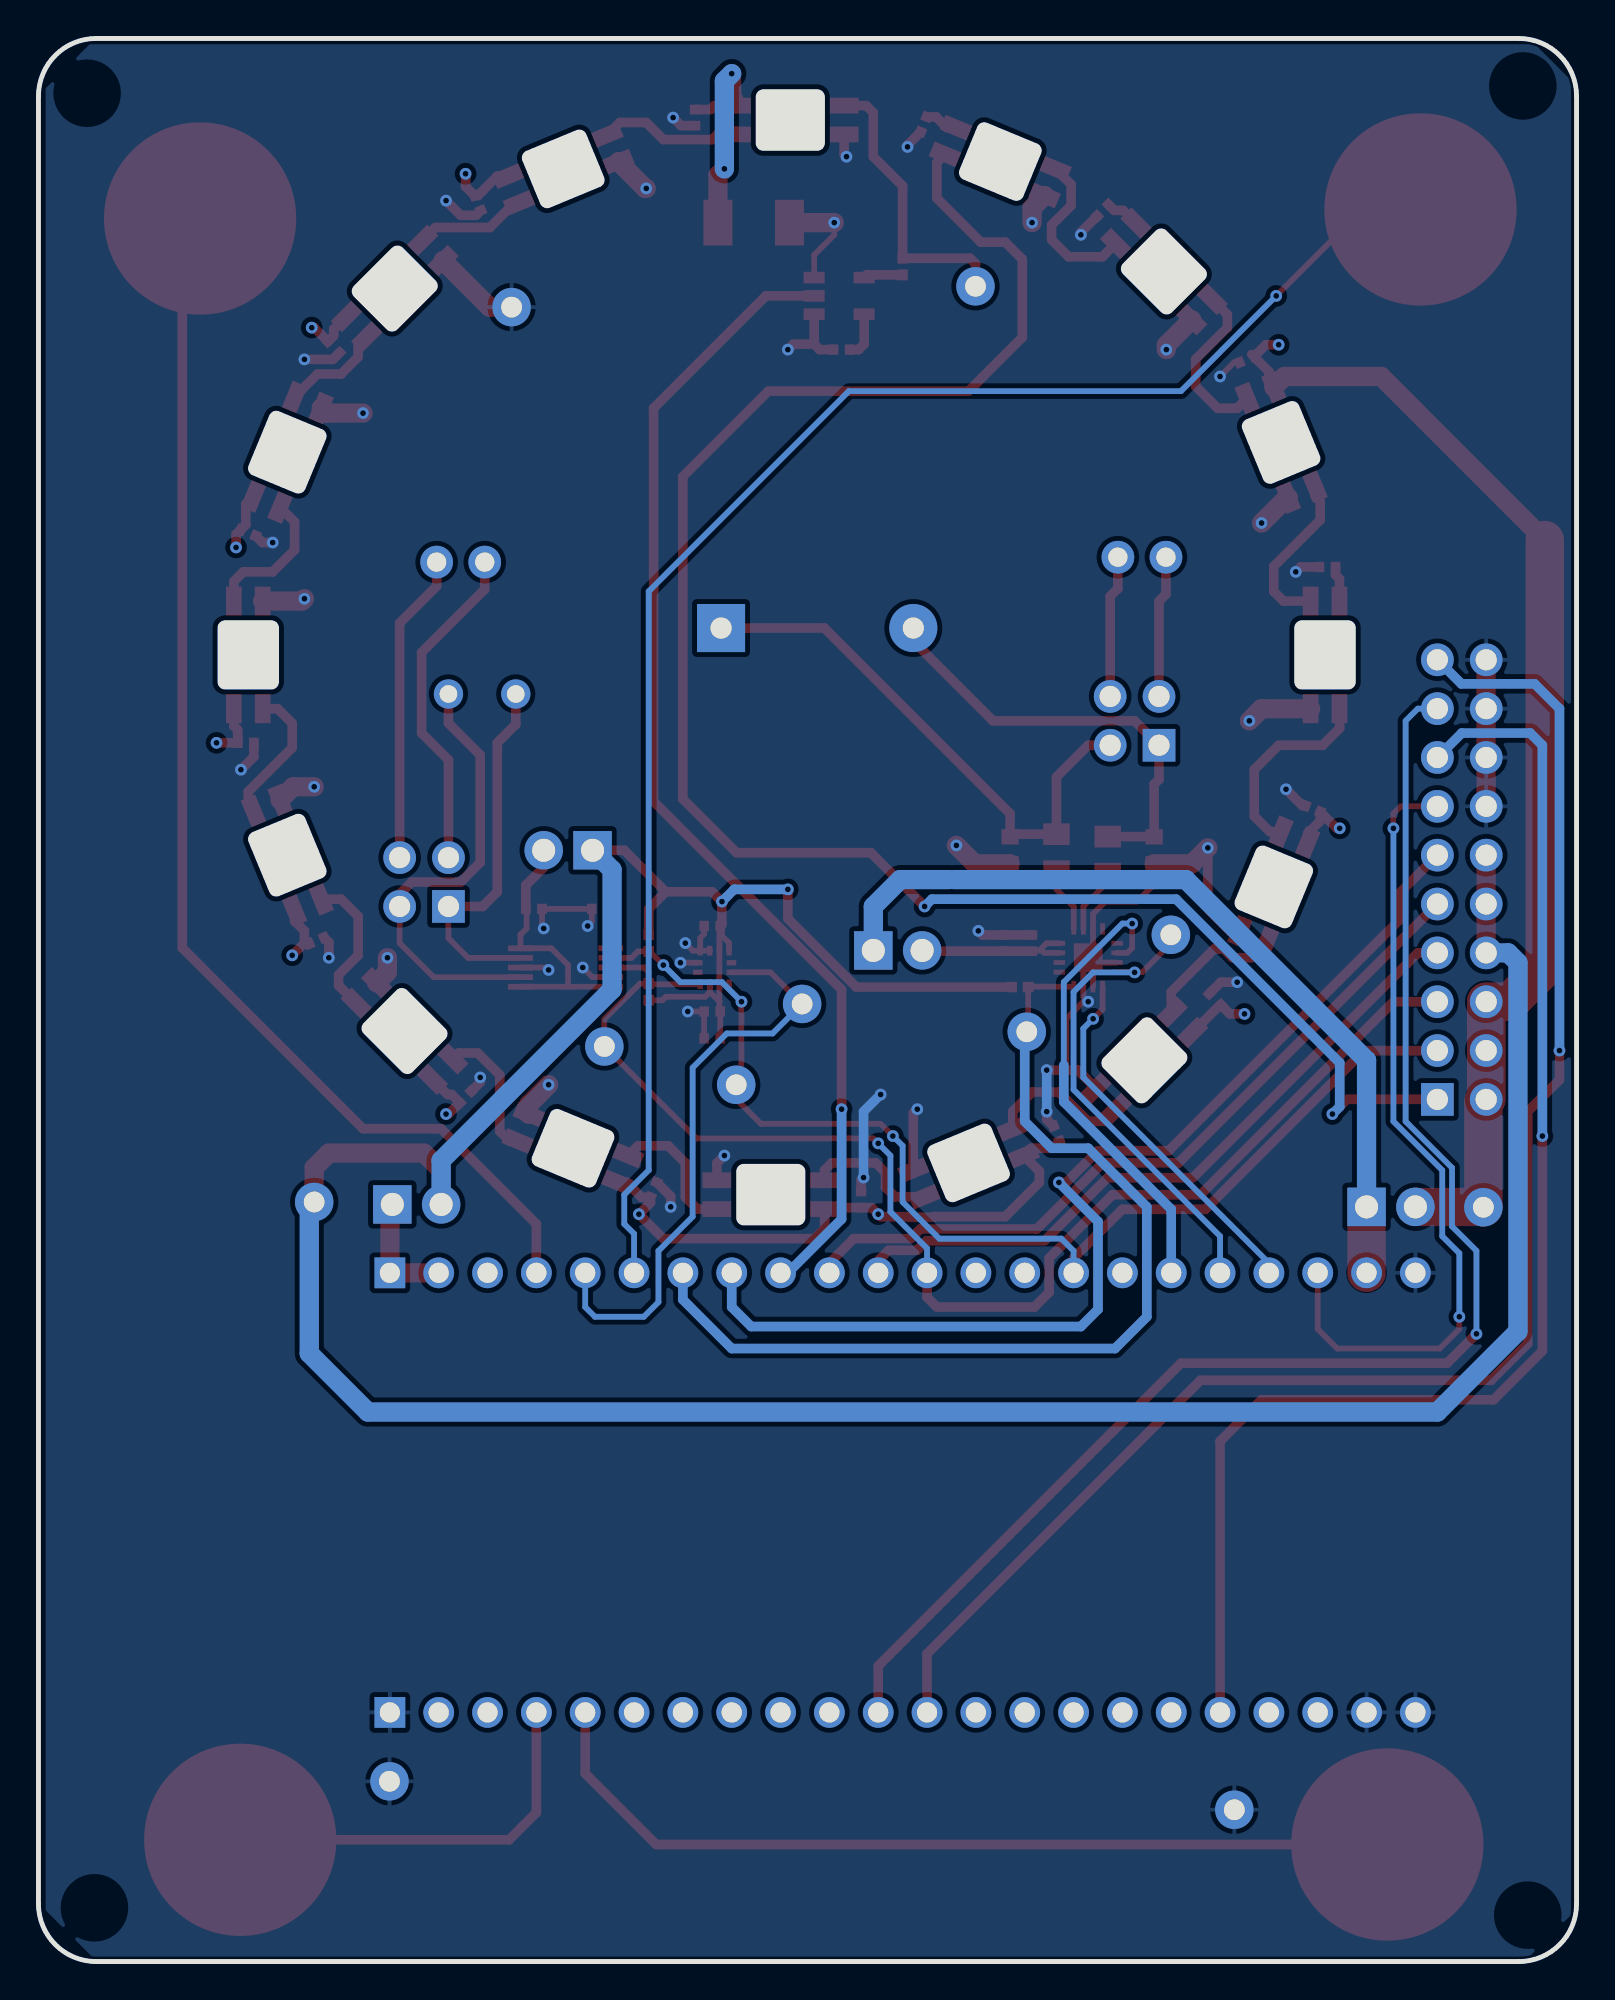
[diagram p2: board, bottom side, seen from below]

Outline 80 x 100 mm; copper layers: Top Layer, Bottom Layer. Coordinates in mm from the lower left corner of the outline.
Outline path: 0,97 0,3 arc(0.88,0.88) 3,0 77,0 arc(79.12,0.88) 80,3 80,97 arc(79.12,99.12) 77,100 3,100 arc(0.88,99.12) 0,97
Stack: Top Layer 0.035mm / Dielectric1 1.51mm FR4 er 4.5 / Bottom Layer 0.035mm

## Design rules (mm)
template: Custom Config
spacing copperThickness1oz (default): track to track 0.102, other pairs 0.152 to 0.3
spacing copperThickness2oz: track to track 0.203, other pairs 0.152 to 0.3
track width copperThickness1oz (default): min 0.127, default 0.3, max 2.54
track width copperThickness2oz: min 0.203, default 0.254, max 2.54
differential pair differentialPair (default): width min 0.127, default 0.254, max 2.54; gap min 0.152, default 0.152
via viaSize (default): diameter min 0.5, default 0.61, max 10; hole min 0.3, default 0.305, max 6.3

## Placement (name value [footprint] x y rotation side)
C1  100nF  [C0402]  38.23 83.82 180 top
C2  100nF  [C0402]  44.96 49.4 180 top
C3  10uF  [C0402]  44.96 48.01 180 top
C4  100nF  [C0402]  44.96 53.85 180 top
C5  1uF  [C0402]  54.23 54.74 0 top
C6  1uF  [C0402]  50.8 54.74 180 top
C7  100nF  [C0402]  45.85 95.89 90 top
C8  100uF  [CASE-B_3528]  42.8 90.42 180 top
C9  100nF  [C0402]  57.15 91.44 67.5 top
C10  100nF  [C0402]  64.64 83.95 45 top
C11  100nF  [C0402]  69.09 74.3 22.5 top
C12  100nF  [C0402]  69.22 63.37 0 top
C13  100nF  [C0402]  65.53 53.09 337.5 top
C14  100nF  [C0402]  57.78 44.96 315 top
C15  100nF  [C0402]  48.01 40.13 292.5 top
C16  10uF  [C0402]  28.32 52.96 270 top
C17  100nF  [C0402]  29.84 52.96 270 top
C18  220pF  [C0603]  21.97 57.78 90 top
C19  220pF  [C0603]  29.46 57.78 90 top
C20  100nF  [C0402]  37.21 39.62 270 top
C21  100nF  [C0402]  27.05 43.05 247.5 top
C22  100nF  [C0402]  18.8 50.04 225 top
C23  100nF  [C0402]  13.72 59.94 202.5 top
C24  100nF  [C0402]  12.95 72.52 180 top
C25  100nF  [C0402]  17.14 83.31 157.5 top
C26  100nF  [C0402]  24.64 91.06 135 top
C27  100nF  [C0402]  33.95 95.53 112.5 top
CN1  B2B-XH-A(LF)(SN)  [CONN-TH_B2B-XH-A-LF-SN]  58.04 72.77 180 top
CN2  B2B-XH-A(LF)(SN)  [CONN-TH_B2B-XH-A-LF-SN]  22.61 73.03 180 top
H1  BX-PM2.54-1-22PY  [HDR-TH_22P-P2.54-V-F]  35.05 35.81 180 top
H2  BX-PM2.54-1-22PY  [HDR-TH_22P-P2.54-V-F]  35.05 12.95 180 top
H3  PZ254V-11-02P  [HDR-TH_2P-P2.54-V-M]  60.32 39.37 180 top
H4  PZ254V-11-02P  [HDR-TH_2P-P2.54-V-M]  9.65 39.24 180 top
H6  PZ254V-12-4P  [HDR-TH_4P-P2.54-V-M-R2-C2-S2.54]  59.94 56.13 0 top
H7  PZ254V-12-4P  [HDR-TH_4P-P2.54-V-M-R2-C2-S2.54]  22.99 64.52 0 top
H8  PZ254V-11-02P  [HDR-TH_2P-P2.54-V-M]  52.45 57.78 0 top
H9  PZ254V-11-02P  [HDR-TH_2P-P2.54-V-M]  35.31 52.58 180 top
H10  X6521WV-2x10H-C60D30  [HDR-TH_20P-P2.54-V-M-R2-C10-S2.54]  5.97 56.26 90 top
K1  TOUCH PAD  [TOUCH_PAD]  69.51 6.33 0 top
K2  TOUCH PAD  [TOUCH_PAD]  9.84 6.09 0 top
K3  TOUCH PAD  [TOUCH_PAD]  71.59 90.64 0 top
K4  TOUCH PAD  [TOUCH_PAD]  8.12 91.11 0 top
L1  GZ2012D601TF  [L0805]  27.05 57.66 90 top
L2  GZ2012D601TF  [L0805]  24.38 57.53 90 top
LED1  SK6812MINI-E  [LED-SMD_L3.2-W2.8-LS5.9_SK6812MINI-E]  40.89 95.76 0 top
LED2  SK6812MINI-E  [LED-SMD_L3.2-W2.8-LS5.9_SK6812MINI-E]  52.71 93.22 337.5 top
LED3  SK6812MINI-E  [LED-SMD_L3.2-W2.8-LS5.9_SK6812MINI-E]  61.47 87 315 top
LED4  SK6812MINI-E  [LED-SMD_L3.2-W2.8-LS5.9_SK6812MINI-E]  67.06 78.49 292.5 top
LED5  SK6812MINI-E  [LED-SMD_L3.2-W2.8-LS5.9_SK6812MINI-E]  69.09 67.94 270 top
LED6  SK6812MINI-E  [LED-SMD_L3.2-W2.8-LS5.9_SK6812MINI-E]  67.06 57.53 247.5 top
LED7  SK6812MINI-E  [LED-SMD_L3.2-W2.8-LS5.9_SK6812MINI-E]  60.96 48.39 225 top
LED8  SK6812MINI-E  [LED-SMD_L3.2-W2.8-LS5.9_SK6812MINI-E]  52.2 42.29 202.5 top
LED9  SK6812MINI-E  [LED-SMD_L3.2-W2.8-LS5.9_SK6812MINI-E]  41.91 39.88 180 top
LED10  SK6812MINI-E  [LED-SMD_L3.2-W2.8-LS5.9_SK6812MINI-E]  31.62 41.53 157.5 top
LED11  SK6812MINI-E  [LED-SMD_L3.2-W2.8-LS5.9_SK6812MINI-E]  22.48 46.86 135 top
LED12  SK6812MINI-E  [LED-SMD_L3.2-W2.8-LS5.9_SK6812MINI-E]  15.75 55.88 112.5 top
LED13  SK6812MINI-E  [LED-SMD_L3.2-W2.8-LS5.9_SK6812MINI-E]  13.08 67.94 90 top
LED14  SK6812MINI-E  [LED-SMD_L3.2-W2.8-LS5.9_SK6812MINI-E]  15.37 78.99 67.5 top
LED15  SK6812MINI-E  [LED-SMD_L3.2-W2.8-LS5.9_SK6812MINI-E]  21.46 87.88 45 top
LED16  SK6812MINI-E  [LED-SMD_L3.2-W2.8-LS5.9_SK6812MINI-E]  29.97 93.6 22.5 top
R1  330Ω  [R0402]  35.05 88.14 90 top
R2  4.7kΩ  [R0402]  48.26 52.96 90 top
R3  4.7kΩ  [R0402]  48.26 50.42 270 top
R4  634kΩ  [R0402]  28.96 50.67 0 top
SPK1  GSPK2307P-8R1W  [SPK-TH_BD23.0-P10.00-D0.8-L-RD]  39.5 69.34 180 top
TP1  3V3  [TESTPOINT-TH_BD3.2_1]  65.66 39.5 0 top
TP2  5V  [TESTPOINT-TH_BD3.2_1]  4.85 39.22 0 top
TP3  GND  [TESTPOINT-TH_BD3.2_1]  17.8 7.89 0 top
TP4  LED_DATA  [TESTPOINT-TH_BD3.2_1]  31.26 87.11 0 top
TP5  I2C_SDA  [TESTPOINT-TH_BD3.2_1]  50.57 47.58 0 top
TP6  I2C_SCL  [TESTPOINT-TH_BD3.2_1]  43.71 45.59 0 top
TP7  I2S_BCLK  [TESTPOINT-TH_BD3.2_1]  21.1 53.39 0 top
TP8  AMP_SD  [TESTPOINT-TH_BD3.2_1]  28.6 48.35 0 top
TP9  IMU_INT  [TESTPOINT-TH_BD3.2_1]  40.28 49.8 0 top
TP10  GND  [TESTPOINT-TH_BD3.2_1]  55.39 86.03 0 top
TP11  GND  [TESTPOINT-TH_BD3.2_1]  61.74 9.37 0 top
U1  SN74AHCT1G125DBVR  [SOT-23-5_L3.0-W1.7-P0.95-LS2.8-BR]  38.35 86.61 0 top
U3  LIS2DW12TR  [LGA-12_L2.0-W2.0-P0.50-BL]  44.83 51.69 0 top
U4  DRV2605LDGSR  [VSSOP-10_L3.0-W3.0-P0.50-LS4.9-BL]  52.58 51.69 270 top
U5  LD0832AA-0099F  [FL_002]  58.67 65.91 180 top
U6  MAX98357AETE+T  [TQFN-16_L3.0-W3.0-P0.50-BL-EP1.5]  25.4 52.2 0 top

## Footprints (pads in the part's own frame, mm; a bottom-side part is the same pattern mirrored in y, then rotated)
C0402
  rect 0.5x0.54 smd: 1(-0.42,0) 2(0.42,0)
C0603
  rect 0.8x0.9 smd: 1(-0.7,0) 2(0.7,0)
CASE-B_3528
  rect 1.506x2.376 smd: 1(-1.861,0) 2(1.861,0)
CONN-TH_B2B-XH-A-LF-SN
  round 1.7 hole 1: 1(1.25,0) 2(-1.25,0)
FL_002
  round 1.524 hole 0.914: 1(0,0) 2(3.5,0)
HDR-TH_2P-P2.54-V-M
  rect 2x2 hole 1.2: 1(-1.27,0)
  round 2 hole 1.2: 2(1.27,0)
HDR-TH_4P-P2.54-V-M-R2-C2-S2.54
  rect 1.7x1.7 hole 1.1: 1(-1.27,-1.27)
  round 1.7 hole 1.1: 2(-1.27,1.27) 3(1.27,-1.27) 4(1.27,1.27)
HDR-TH_20P-P2.54-V-M-R2-C10-S2.54
  rect 1.7x1.7 hole 1.1: 1(-11.43,-1.27)
  round 1.7 hole 1.1: 2(-11.43,1.27) 3(-8.89,-1.27) 4(-8.89,1.27) 5(-6.35,-1.27) 6(-6.35,1.27) 7(-3.81,-1.27) 8(-3.81,1.27) 9(-1.27,-1.27) 10(-1.27,1.27) 11(1.27,-1.27) 12(1.27,1.27) 13(3.81,-1.27) 14(3.81,1.27) 15(6.35,-1.27) 16(6.35,1.27) 17(8.89,-1.27) 18(8.89,1.27) 19(11.43,-1.27) 20(11.43,1.27)
HDR-TH_22P-P2.54-V-F
  rect 1.6x1.6 hole 1.05: 1(-26.67,0)
  round 1.6 hole 1.05: 2(-24.13,0) 3(-21.59,0) 4(-19.05,0) 5(-16.51,0) 6(-13.97,0) 7(-11.43,0) 8(-8.89,0) 9(-6.35,0) 10(-3.81,0) 11(-1.27,0) 12(1.27,0) 13(3.81,0) 14(6.35,0) 15(8.89,0) 16(11.43,0) 17(13.97,0) 18(16.51,0) 19(19.05,0) 20(21.59,0) 21(24.13,0) 22(26.67,0)
L0805
  rect 1.133x1.377 smd: 1(-0.966,0) 2(0.966,0)
LED-SMD_L3.2-W2.8-LS5.9_SK6812MINI-E
  rect 1.5x0.82 smd: 1(2.8,0.75) 2(2.8,-0.75) 3(-2.8,-0.75) 4(-2.8,0.75)
LGA-12_L2.0-W2.0-P0.50-BL
  rect 0.28x0.5 smd: 1(-0.75,-0.875) 2(-0.25,-0.875) 3(0.25,-0.875) 4(0.75,-0.875) 7(0.75,0.875) 8(0.25,0.875) 9(-0.25,0.875) 10(-0.75,0.875)
  rect 0.5x0.28 smd: 5(0.875,-0.25) 6(0.875,0.25) 11(-0.875,0.25) 12(-0.875,-0.25)
R0402
  rect 0.566x0.54 smd: 1(-0.433,0) 2(0.433,0)
SOT-23-5_L3.0-W1.7-P0.95-LS2.8-BR
  rect 1.1x0.6 smd: 1(1.3,-0.95) 2(1.3,0) 3(1.3,0.95) 4(-1.3,0.95) 5(-1.3,-0.95)
SPK-TH_BD23.0-P10.00-D0.8-L-RD
  rect 2.5x2.5 hole 1.1: 1(-5,0)
  round 2.5 hole 1.1: 2(5,0)
TESTPOINT-TH_BD3.2_1
  round 2 hole 1.08: 1(0,0)
TOUCH_PAD
  round 10 smd: 1(0,0)
TQFN-16_L3.0-W3.0-P0.50-BL-EP1.5
  rect 0.25x0.6 smd: 1(-0.749,-1.5) 2(-0.248,-1.5) 3(0.252,-1.5) 4(0.751,-1.5) 9(0.75,1.5) 10(0.25,1.5) 11(-0.25,1.5) 12(-0.749,1.5)
  rect 0.6x0.25 smd: 5(1.5,-0.748) 6(1.5,-0.248) 7(1.5,0.252) 8(1.5,0.752) 13(-1.5,0.752) 14(-1.5,0.252) 15(-1.5,-0.248) 16(-1.5,-0.748)
  rect 1.5x1.5 smd: 17(0,0)
VSSOP-10_L3.0-W3.0-P0.50-LS4.9-BL
  rect 0.3x1.3 smd: 1(-1,-2.35) 2(-0.5,-2.35) 3(0,-2.35) 4(0.5,-2.35) 5(1,-2.35) 6(1,2.35) 7(0.5,2.35) 8(0,2.35) 9(-0.5,2.35) 10(-1,2.35)

## Nets
As in the schematic.

Pads without a net: U3 5 11; U6 5 6 12 13

## Via types
v1: diameter 0.61, hole 0.305, Top Layer to Bottom Layer, 76 vias

## Routing (per net, layer and track width the routed paths; a pad name or vN(x,y) marks a point on that pad's centre or on a via; arc(x,y) is an arc through that point)
3V3: length 175.2
  Top Layer w0.3: C3.2 C2.2 44.58,49.45 44.58,49.92 ; 44.58,49.92 U3.2 U3.9 44.58,53.81 ; 44.58,49.92 45.08,50.42 ; U3.10 44.08,52.97 44.45,53.34 44.45,53.94 ; 45.08,50.42 45.33,50.17 47.37,50.17 47.55,49.99 R3.2 ; 45.08,50.42 U3.3
  Top Layer w0.5: H8.1 49.53,57.78 47.37,55.63 ; v1(41.02,55.75) 41.02,54.23 37.47,50.67 R4.2 ; 47.37,55.63 44.96,55.63 v1(44.45,55.12) 44.45,53.94 C4.2 ; 47.37,55.63 48.26,54.74 R2.2
  Top Layer w1: H10.8 H10.10 4.7,57.53 ; TP1.1 65.66,41.28 64.9,42.04 59.94,42.04 59.06,41.15 59.06,39.37
  Bottom Layer w0.5: v1(44.45,55.12) 43.81,55.75 v1(41.02,55.75)
  Bottom Layer w1: H10.8 3.56,52.45 3.05,51.94 3.05,32.77 7.24,28.57 62.87,28.57 65.91,31.62 65.91,39.24 TP1.1 ; H8.1 50.16,56.77 50.16,50.55 59.06,41.66 59.06,39.37
+5V: length 137.2
  Top Layer w0.5: v1(57.78,92.96) 57.78,92.3 57.31,91.83 57.14,91.83 56.13,92.84 55.58,92.84 ; LED11.1 18.54,49.74 18.5,49.74 18.03,49.28 v1(17.27,49.28) ; LED4.1 69.22,75.79 69.22,74.72 C11.2 69.72,74.21 v1(69.72,73.53) ; LED3.1 64.64,84.88 64.64,84.54 C10.2 65.66,84.96 v1(65.79,84.96) ; v1(15.49,84.07) 16.16,84.07 C25.2 ; U1.5 37.05,84.1 37.34,83.82 C1.2 ; 33.79,95.92 33.31,95.92 32.75,95.36 LED16.1 ; LED5.1 69.84,64.25 69.63,64.05 C12.2 v1(70.74,63.37) ; v1(66.8,52.32) 66.2,52.92 65.92,52.92 66.17,53.17 66.17,53.59 66.68,54.1 66.68,54.66 ; 16.89,83.57 16,82.68 16,82.12 LED14.1 ; LED13.1 12.33,71.89 12.53,72.1 C24.2 ; v1(12.32,58.93) 12.47,58.93 C23.2 13.33,59.32 13.98,58.66 LED12.1 ; LED1.1 44.84,96.51 45.05,96.31 45.85,96.31 ; v1(58.8,44.07) 58.67,44.07 58.08,44.66 58.51,45.08 58.72,45.08 LED7.1 ; 49.9,40.53 49.42,40.53 48.63,39.74 48.17,39.74 48.17,39.46 v1(48.77,38.86) 47.5,37.59 39.62,37.59 39.11,38.11 LED9.1 39.03,39.2 C20.2 36.66,39.2 v1(36.32,38.86) 36.19,38.73 34.66,38.73 34.63,38.7 33.48,38.7 33.44,38.73 29.72,38.73 27.94,40.51 27.94,41.1 28.75,41.91 28.37,42.29 27.26,42.29 C21.2 ; LED15.1 23.58,91.06 24.04,91.06 24.34,91.36
  Top Layer w1: 1.65,73.91 10.16,82.42 15.19,82.42 LED14.1 ; 43.81,96.77 43.94,96.9 v1(43.94,98.17) ; v1(44.32,93.22) 44.66,92.88 C8.1
  Top Layer w2: 1.65,73.91 1.65,51.69 3.43,49.91 H10.6 H10.4 4.7,44.83 4.85,44.68 TP2.1 4.87,39.24 H4.2
  Bottom Layer w1: v1(43.94,98.17) 44.32,97.79 v1(44.32,93.22)
GND: length 125.4
  Top Layer w0.3: U1.3 39.65,88.74 38.61,89.79 v1(38.61,90.42) ; U3.7 45.96,52.56 v1(46.35,52.96) ; U3.7 U3.8 ; U3.7 45.58,53.22 45.38,53.43 C4.1 ; C3.1 C2.1 v1(46.23,49.4) ; U3.6 v1(46.61,51.94) ; U4.8 53.59,51.69 v1(53.47,51.56) ; v1(51.69,51.69) 51.19,51.19 U4.4 ; v1(18.54,82.42) 17.81,83.15 17.53,83.15 ; v1(53.72,53.72) 53.81,53.81 53.81,54.74 C6.1 51.22,54.06 v1(51.44,53.85) ; 26.82,46.36 26.54,46.64 26.54,49.02 25.65,49.91 v1(25.4,49.91) 25.65,50.16 U6.3 25.65,51.95 U6.17 25.15,52.45 U6.11 25.15,54.48 24.51,55.12 22.86,55.12 21.97,56.01 C18.1 ; U6.2 25.15,51.95 U6.15
  Top Layer w0.5: LED10.3 34.5,44.12 v1(34.29,44.32) ; C1.1 39.37,83.82 39.65,84.1 ; C16.1 C17.1 30.9,53.38 v1(31.12,53.59) ; C20.1 37.21,40.64 v1(37.08,40.77) ; 24.94,90.76 25.78,89.92 v1(25.78,89.79) ; v1(34.8,94.36) 34.8,94.45 C27.1 ; C12.1 68.79,62.65 v1(69.47,61.98) ; v1(67.82,73.79) 68.35,73.79 C11.1 ; U1.1 39.65,84.1 ; 39.65,84.1 40.74,84.1 v1(41.02,83.82) ; v1(15.11,60.96) 14.26,60.11 C23.1 ; LED12.3 18.02,53.58 19.18,54.74 v1(19.18,57.91) ; 27.21,43.44 27.56,43.79 v1(27.56,44.2) ; 65.14,53.25 64.9,53 v1(64.9,52.2) ; v1(14.61,72.26) 14.35,72.52 C24.1 ; v1(17.65,50.93) 18.5,50.93 19.09,50.33 ; 57.49,45.25 57.02,45.72 v1(57.02,45.97) ; v1(27.56,46.36) 25.93,46.36 LED11.3 ; 56.99,91.05 57.24,90.81 58.04,90.81 v1(58.8,91.57) ; v1(66.17,83.31) 64.68,83.31 C10.1 ; C7.1 46.57,95.47 v1(46.99,95.89) ; LED1.3 38.09,93.97 v1(37.97,93.85) ; 47.84,40.52 47.12,39.79 v1(47.12,39.24) ; v1(44.32,41.91) 44.71,41.52 LED9.3
  Top Layer w1: LED14.3 15.07,76.12 v1(16.38,74.8) ; TP10.1 56.54,86.03 LED3.3 ; v1(63.12,80.52) 65.02,80.52 LED4.3 ; C19.1 31.3,57.08 v1(32.26,58.04) ; v1(66.17,70.87) 66.29,70.75 LED5.3 ; LED7.3 61.85,51.46 v1(61.85,52.2) ; C8.2 v1(38.61,90.42) ; C18.1 20,57.08 v1(19.18,57.91) ; v1(65.66,61.09) 66.75,61.09 LED6.3 ; v1(53.47,45.59) 54.5,44.56 LED8.3 ; LED16.3 28.32,91.19 v1(28.32,90.42) ; v1(48.39,92.2) 48.44,92.2 LED2.3 ; LED13.3 16.39,65.14 v1(17.02,64.52) ; LED15.3 21.34,84.05 v1(21.34,83.82) ; H10.14 H10.18 H10.20
  Bottom Layer w0.5: v1(27.56,44.2) v1(27.56,46.36) ; v1(36.19,45.08) 37.08,44.2 v1(37.08,40.77)
VCC_5V: length 8.4
  Top Layer w0.3: 27.94,52.58 27.81,52.58 27.68,52.45 U6.7 ; 27.94,52.58 28.28,52.58 C16.2 ; 27.94,52.58 27.57,52.95 U6.8
  Top Layer w0.5: H9.2 34,52.54 C17.2 C16.2
AMP_SD: length 50.6
  Top Layer w0.3: U6.4 28.5,50.7 R4.1 28.52,48.42 TP8.1
  Bottom Layer w0.5: TP8.1 28.7,48.24 28.7,43.69 27.31,42.29 25.4,42.29 22.35,39.24 22.35,33.53 24,31.88 43.94,31.88 46.48,34.42 H1.7
DOU1: length 7.5
  Top Layer w0.5: 50.41,94.98 49.76,95.63 48.39,95.63 47.5,94.74 44.96,94.74 44.69,95.01 LED1.2
DOU2: length 5.8
  Top Layer w0.5: LED2.2 55.23,91.45 56.51,90.17 59.35,90.17 LED3.4
DOU3: length 5.4
  Top Layer w0.5: LED3.2 63.37,84.03 63.37,83.44 64.26,82.55 65.49,82.55 LED4.4
DOU4: length 7.4
  Top Layer w0.5: LED4.2 66.68,74.85 66.68,73.41 67.82,72.26 69.34,72.26 69.84,71.77 LED5.4
DOU5: length 7.5
  Top Layer w0.5: 68.82,59.83 69.09,60.1 69.09,60.83 66.8,63.12 66.8,64.39 67.56,65.14 LED5.2
DOU6: length 7.6
  Top Layer w0.5: LED6.2 65.28,55.25 64.26,55.25 63.37,54.36 63.37,52.32 64.39,51.31 64.39,50.76 LED7.4
DOU7: length 7.1
  Top Layer w0.5: LED7.2 58.14,47.24 57.15,47.24 56.01,46.1 56.01,43.18 55.5,42.67 55.07,42.67
DOU8: length 7.2
  Top Layer w0.5: LED8.2 48.82,42.42 47.24,42.42 46.35,41.53 46.35,39.75 45.73,39.13 LED9.4
DOU9: length 7
  Top Layer w0.5: 33.92,39.76 35.45,39.76 35.94,40.26 35.94,41.02 36.45,41.53 38.74,41.53 39.11,41.15 LED9.2
DOU10: length 7.6
  Top Layer w0.5: LED11.4 24.59,43.69 25.4,43.69 26.92,45.21 28.32,45.21 29.32,44.21 LED10.2
DOU11: length 7.5
  Top Layer w0.5: LED11.2 21.08,49.43 21.08,50.42 18.86,52.64 18.35,52.64 17.9,52.2 16.94,52.2 LED12.4
DOU12: length 10.5
  Top Layer w0.5: LED12.2 15.95,58.75 16.76,59.56 16.76,61.98 15.49,63.25 13.21,63.25 12.32,64.14 12.32,65.13 LED13.4
DOU13: length 8.7
  Top Layer w0.5: LED13.2 15.25,70.75 15.75,71.25 15.75,72.55 13.33,74.96 13.33,75.95 13.6,76.21 LED14.4
DOU14: length 8.9
  Top Layer w0.5: LED15.4 18.16,85.64 18.16,84.96 19.81,83.31 19.81,81.92 18.67,80.77 17.65,80.77 LED14.2
DOU15: length 8.4
  Top Layer w0.5: LED16.4 26.29,92.41 26.29,91.31 27.31,90.3 27.31,89.53 26.42,88.65 24.66,88.65 LED15.2
DOUT16: length 98.5
  Top Layer w0.5: 7.24,44.83 11.94,44.83 v1(12.7,44.07) ; v1(33.91,54.86) 36.7,57.66 43.69,57.66 46.48,60.45 46.48,77.22 42.04,81.66 31.62,81.66 28.83,84.45 28.83,88.52 29.72,89.41 30.99,89.41 33.27,91.69 33.27,93.55 LED16.2
  Bottom Layer w0.5: v1(33.91,54.86) 33.53,55.25 20.83,55.25 12.32,46.74 12.32,44.45 v1(12.7,44.07)
DRV_3V3: length 14.3
  Top Layer w0.3: 52.46,50.69 52.46,51.82 53.32,52.69 U4.10 54.93,53.4 54.61,53.72 54.61,54.7 C5.2 ; 52.46,50.69 U4.6 ; 52.46,50.69 U4.5
  Top Layer w0.5: H8.2 53.72,56.9 54.65,55.97 C5.2
ESP_3V3: length 6.1
  Top Layer w1: H3.1 61.72,39.24 H1.1 H1.2
ESP_5V: length 43.2
  Top Layer w2: H4.1 H1.21
  Bottom Layer w1: H4.1 10.92,46.86 20.32,56.26 32.38,56.26 ; H9.1 36.58,54.86 35.18,56.26 32.64,56.26
GPIO1: length 21.2
  Top Layer w0.5: K1.1 55.52,6.33 54.1,7.75 H2.4
GPIO2: length 46.4
  Top Layer w0.5: H2.5 51.56,9.78 47.87,6.09 K2.1
GPIO4: length 65.2
  Top Layer w0.5: H1.4 54.1,38.35 59.06,43.31 63.12,43.31 72.52,52.7 72.52,89.71 K3.1
GPIO6: length 84.5
  Top Layer w0.3: K4.1 11.13,91.11 v1(15.62,86.61)
  Bottom Layer w0.3: v1(15.62,86.61) 20.57,81.66 37.85,81.66 48.26,71.25 48.26,41.15 49.53,39.88 49.53,38.35 49.02,37.85 H1.6
GPIO14: length 41.8
  Top Layer w0.3: v1(6.1,33.53) 6.1,32.89 7.11,31.88 12.45,31.88 13.46,32.89 H1.20 ; v1(9.53,58.93) 9.53,59.69 9.14,60.07 7.24,60.07
  Bottom Layer w0.3: v1(6.1,33.53) 6.1,36.83 6.98,37.72 6.98,41.15 9.53,43.69 v1(9.53,58.93)
GPIO15: length 56.6
  Top Layer w0.5: 7.24,57.53 9.27,55.5 9.27,54.1 21.21,42.16 24.89,42.16 26.54,40.51 v1(26.92,40.51)
  Bottom Layer w0.5: H1.8 43.94,34.04 42.93,33.02 25.78,33.02 24.89,33.91 24.89,38.48 v1(26.92,40.51)
GPIO17: length 39.9
  Top Layer w0.5: H1.10 38.86,36.32 37.59,37.59 34.63,37.59 34.13,38.09 28.07,38.09 24.64,41.53 20.7,41.53 7.24,54.99
GPIO18: length 36.2
  Top Layer w0.5: 7.24,52.45 8.25,52.45 19.94,40.77 24.38,40.77 27.67,37.48 33.81,37.48 34.31,36.98 35.79,36.98 36.64,36.13
GPIO21: length 70.6
  Top Layer w0.5: v1(1.78,42.93) 1.78,31.75 4.32,29.21 16.38,29.21 18.54,27.05 H2.18
  Bottom Layer w0.5: 7.24,62.61 5.97,63.88 2.41,63.88 1.78,63.25 v1(1.78,42.93)
GPIO36: length 82.1
  Top Layer w0.5: v1(0.89,47.37) 0.89,45.85 2.54,44.2 2.54,32.13 4.44,30.23 19.56,30.23 33.78,16 H2.12
  Bottom Layer w0.5: 7.24,67.69 5.99,66.44 2.18,66.44 0.89,65.15 v1(0.89,47.37)
GPIO37: length 76
  Top Layer w0.5: v1(5.21,32.64) 6.73,31.12 20.57,31.12 36.32,15.37 H2.11
  Bottom Layer w0.3: v1(5.21,32.64) 5.21,36.96 6.48,38.23 6.48,41.28 8.89,43.69 8.89,64.52 8.25,65.15 7.24,65.15
I2C_SCL: length 62.2
  Top Layer w0.3: v1(35.56,42.93) 36.19,43.56 42.42,43.56 43.71,44.85 TP6.1 43.43,45.87 v1(43.43,49.91) 44.08,50.56 U3.1 ; v1(47.5,51.82) 48.21,52.53 R2.1 48.82,52.53 49.16,52.19 U4.2
  Top Layer w0.5: 7.24,47.37 11.05,47.37 19.3,39.12 23.62,39.12 26.16,36.58 H1.15
  Bottom Layer w0.3: v1(47.5,51.82) 46.61,50.93 44.45,50.93 v1(43.43,49.91) ; H1.15 26.16,36.96 26.8,37.59 33.15,37.59 35.05,39.5 35.05,42.42 v1(35.56,42.93)
I2C_SDA: length 69.6
  Top Layer w0.3: R3.1 48.26,51.44 48.51,51.69 U4.3 ; R3.1 48.72,50.85 50.57,49 TP5.1 45.78,42.8 36.58,42.8 v1(36.32,42.55) ; R3.1 48.22,50.81 U3.4
  Top Layer w0.5: H1.12 33.78,34.54 33.27,34.04 28.19,34.04 27.43,34.8 27.43,36.58 24.13,39.88 19.56,39.88 9.53,49.91 7.24,49.91
  Bottom Layer w0.3: v1(36.32,42.55) 35.69,41.91 35.69,38.99 33.78,37.08 H1.12
I2S_BCLK: length 25.3
  Top Layer w0.3: 22.92,51.45 22.93,51.44 v1(22.99,51.44) ; 22.92,51.45 22.59,51.45 21.1,52.94 TP7.1 ; 22.92,51.45 U6.16
  Bottom Layer w0.3: H1.18 18.54,37.72 26.16,45.34 26.16,50.42 25.15,51.44 v1(22.99,51.44)
I2S_DIN: length 19.3
  Top Layer w0.3: U6.1 24.65,49.52 v1(25.15,49.02)
  Bottom Layer w0.3: v1(25.15,49.02) 25.65,48.51 25.65,45.97 16,36.32 H1.19
I2S_LRCLK: length 24.4
  Top Layer w0.3: U6.14 23.37,52.45 23.11,52.7 v1(23.11,53.97)
  Bottom Layer w0.3: 26.67,46.61 26.67,50.93 23.62,53.97 v1(23.11,53.97)
  Bottom Layer w0.5: 26.67,46.61 26.67,44.7 21.08,39.12 H1.17
IMU_INT: length 30.5
  Top Layer w0.3: U3.12 41.92,51.44 TP9.1
  Bottom Layer w0.3: H1.5 51.56,34.04 51.05,33.53 48.51,33.53 47.75,34.29 47.75,36.96 45.97,38.73 45.97,46.48 44.2,48.26 41.81,48.26 TP9.1
LED_DATA_3V3: length 61.3
  Top Layer w0.5: U1.2 42.16,86.61 48.01,80.77 48.01,60.33 38.23,50.55 v1(38.23,44.32)
  Bottom Layer w0.5: H1.9 41.02,35.81 38.23,38.61 v1(38.23,44.32)
LED_DATA_5V: length 15
  Top Layer w0.5: LED1.4 36.94,96.51 36.58,96.14 36.58,93.85 35.05,92.33 R1.2 31.55,88.57 31.26,88.29 TP4.1
MOT1+: length 17.3
  Top Layer w0.5: CN1.1 56.79,71.35 60.07,68.07 60.07,63.88 58.67,62.48 H6.2
MOT1-: length 16.2
  Top Layer w0.5: CN1.2 59.29,71.52 61.21,69.6 H6.4
MOT+: length 19.4
  Top Layer w0.3: H6.1 58.67,53.21 57.65,52.19 U4.9
  Top Layer w0.5: U5.2 55.17,64.33 56.13,63.37 56.13,55.63 56.9,54.86 H6.1
MOT-: length 23.9
  Top Layer w0.3: H6.3 61.21,52.96 59.44,51.19 U4.7
  Top Layer w0.5: U5.1 58.67,64.39 57.02,62.74 57.02,57.15 58.04,56.13 60.58,56.13 61.21,55.5 H6.3
REG: length 2.1
  Top Layer w0.3: U4.1 50.38,52.84 C6.2
SPK1+: length 7.4
  Top Layer w0.5: H7.4 24.26,70.99 23.86,71.39 CN2.2
SPK1-: length 7.4
  Top Layer w0.5: H7.2 21.72,70.74 21.36,71.1 CN2.1
SPK+: length 29.2
  Top Layer w0.5: SPK1.1 39.12,69.34 29.46,59.69 C19.2 29.32,58.62 L1.2 27.05,61.59 25.4,63.25 H7.3
SPK-: length 23
  Top Layer w0.5: L2.2 21.98,58.5 C18.2 21.97,61.21 21.72,61.47 H7.1 22.99,64.52 30.35,64.52 34.5,68.66 SPK1.2
$1N2845: length 3.4
  Top Layer w0.3: U6.10 25.65,54.87 24.38,56.13 24.38,56.56
$1N2846: length 3.4
  Top Layer w0.3: U6.9 26.15,54.85 27.05,55.75 L1.1
$1N3639: length 2.1
  Top Layer w0.5: R1.1 36.91,87.7 U1.4

## Copper pours and planes (outline as drawn; the poured copper is in the pictures)
+5V on Top Layer: 77.22,99.69 79.63,97.28 79.63,2.67 77.22,0.25 2.54,0.25 0.25,2.54 0.25,97.66 2.29,99.69
GND on Bottom Layer: 77.34,99.69 79.63,97.41 79.63,2.67 77.22,0.25 2.45,0.25 0.3,2.41 0.3,97.83 2.16,99.69

## Text on the board
Top Silkscreen Layer: GND | 5V | IO14 | IO19 | IO20 | IO13 | IO21 | IO12 | IO47 | IO11 | IO10 | IO48 | IO45 | IO9 | IO46 | IO0 | IO35 | IO3 | IO36 | IO8 | IO37 | IO18 | IO38 | IO17 | IO39 | IO16 | IO40 | IO15 | IO41 | IO7 | IO42 | IO6 | IO5 | IO2 | IO1 | IO4 | RX0 | RST | TX0 | 3V3 | SDA | SCL | DOUT | LED1 | MOT1- | MOT2- | GPIO6 | GPIO2 | SPK+ | SPK1- | SPK- | SPK2- | LED_DATA | AMD SD | AUDIO | IMU INT | SPEAKER | HAPTIC | MOT+ | MOT- | GPIO1 | GPIO4 | ESP32 S3 DEV KIT
